# Altium schematic sheet SD card.SchDoc: MICRO SD 3.0 Card
size A4; DocumentNumber: MB1246; Revision: B.1; SheetNumber: 12; SheetTotal: 17; Project: STM32H7xxI-EVAL
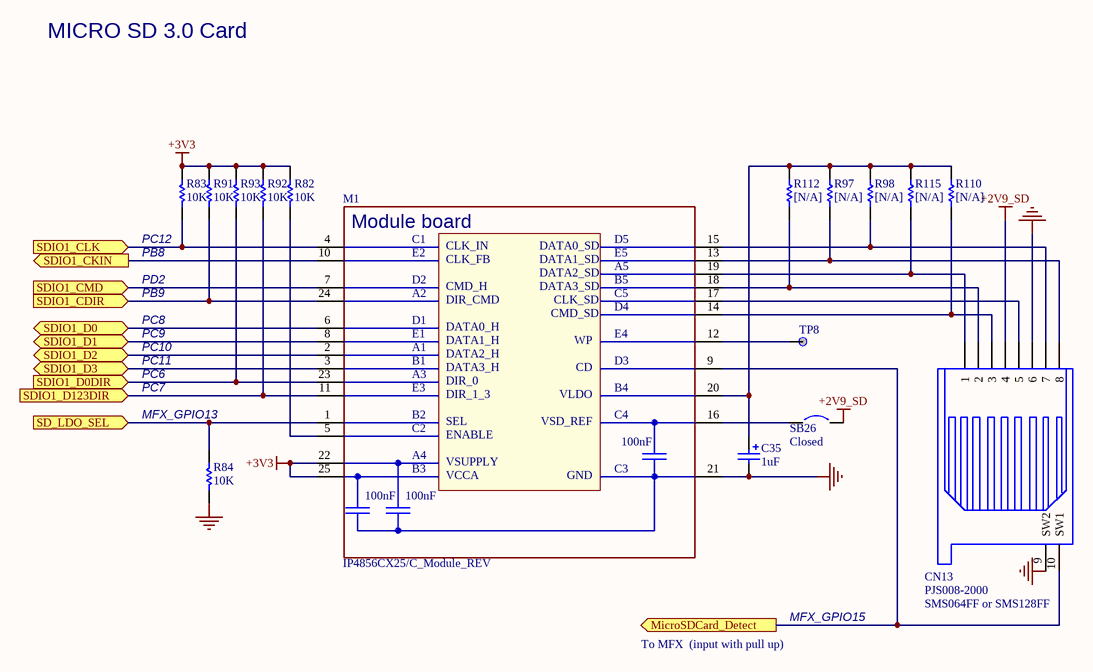
[diagram p0: SD card.SchDoc]

## Parts
C35  1uF  [TAN-A]
CN13  PJS008-2000  [MSD_PJS008_]
M1  IP4856CX25/C_Module_REV  [WLCSP25_0R4_MOUDLE_REV]
R82  10K  [0603R]
R83  10K  [0603R]
R84  10K  [0603R]
R91  10K  [0603R]
R92  10K  [0603R]
R93  10K  [0603R]
R97  [N/A]  [0603R]
R98  [N/A]  [0603R]
R110  [N/A]  [0603R]
R112  [N/A]  [0603R]
R115  [N/A]  [0603R]
SB26  Closed  [SB_0603]
TP8  (no value)  [TP]

## Ports
MicroSDCard_Detect (out), SD_LDO_SEL (in), SDIO1_CDIR (in), SDIO1_CKIN (out), SDIO1_CLK (in), SDIO1_CMD (in), SDIO1_D0 (bidir), SDIO1_D0DIR (in), SDIO1_D1 (bidir), SDIO1_D2 (bidir), SDIO1_D3 (bidir), SDIO1_D123DIR (in)

## Nets
+2V9_SD: CN13.4 SB26.1
+3V3: M1.22(CD) M1.25(GND) R82.2 R83.2 R91.2 R92.2 R93.2
GND: C35.2 CN13.6 CN13.9(SW2) M1.21(WP) R84.1
MicroSDCard_Detect: CN13.10(SW1) M1.9(DIR_0) ; port MicroSDCard_Detect
SD_LDO_SEL: M1.1(CLK_IN) R84.2 ; port SD_LDO_SEL
SDIO1_CDIR: M1.24(VSD_REF) R91.1 ; port SDIO1_CDIR
SDIO1_CKIN: M1.10(DIR_1_3) ; port SDIO1_CKIN
SDIO1_CLK: M1.4(DIR_CMD) R83.1 ; port SDIO1_CLK
SDIO1_CMD: M1.7(DATA2_H) ; port SDIO1_CMD
SDIO1_D0: M1.6(DATA1_H) ; port SDIO1_D0
SDIO1_D0DIR: M1.23(VLDO) R93.1 ; port SDIO1_D0DIR
SDIO1_D1: M1.8(DATA3_H) ; port SDIO1_D1
SDIO1_D2: M1.2(CLK_FB) ; port SDIO1_D2
SDIO1_D3: M1.3(CMD_H) ; port SDIO1_D3
SDIO1_D123DIR: M1.11(SEL) R92.1 ; port SDIO1_D123DIR
NetC35_1: C35.1 M1.20(CMD_SD) R97.1 R98.1 R110.1 R112.1 R115.1
NetCN13_1: CN13.1 M1.19(CLK_SD) R115.2
NetCN13_2: CN13.2 M1.18(DATA3_SD) R112.2
NetCN13_3: CN13.3 M1.14(VCCA) R110.2
NetCN13_5: CN13.5 M1.17(DATA2_SD)
NetCN13_7: CN13.7 M1.15(DATA0_SD) R98.2
NetCN13_8: CN13.8 M1.13(VSUPPLY) R97.2
NetM1_5: M1.5(DATA0_H) R82.1
NetM1_12: M1.12(ENABLE) TP8.1
NetM1_16: M1.16(DATA1_SD) SB26.2

## Notes on the sheet
- MICRO SD 3.0 Card
- PC12
- PB8
- PB9
- PD2
- PC6
- PC8
- PC9
- PC10
- PC11
- PC7
- (near R84) MFX_GPIO13
- To MFX  (input with pull up)
- MFX_GPIO15
- SMS064FF or SMS128FF
- Title:
- Project:
- Size:
- Date:
- A4
- Reference:
- Sheet:
- Revision:
- of
- (in symbol IP4856CX25/C_Module_REV) Module board; C1; D5; E2; E5; A5; D2; B5; A2; C5; D4; D1; E1; E4; A1; B1; D3; A3; E3; B4; B2; C4; C2; 100nF; A4; B3; C3

## Library data of the parts
C35 = Cap Pol1: Polarized Capacitor (Radial); Value: 10uF; Published: 8-Jun-2000; Revision: July-2002: Re-released for DXP Platform.; Publisher: Altium Limited
CN13 = SMS016AFA5E
M1 = IP4856CX25/C_Module_REV: SDcard3.0 dual voltage level  translator; ECCN_US/EU: 3A991
R82-R84 R91-R93 = Res1: Resistor; Value: 1K; Published: 8-Jun-2000; Revision: July-2002: Re-released for DXP Platform.; Publisher: Altium Limited
R97 R98 R110 R112 R115 = res1: Resistor; Value: 1K; Published: 8-Jun-2000; Revision: July-2002: Re-released for DXP Platform.; Publisher: Altium Limited
SB26 = Circuit Breaker_close: Circuit Breaker; Published: 24-Mar-1999; Revision: July-2002: Re-released for DXP Platform.; Publisher: Altium Limited
TP8 = TP